# Altium schematic sheet Arduino.SchDoc: Arduino
size 420 x 297 mm; Author: P. Zdunek; CompanyName: WUT ISE; DrawnBy: P. Zdunek; Organization: WUT ISE; Address1: PW ISE; Address2: Nowowiejska 15/19 00-665 Warsaw; Address3: p.zdunek90@gmail.com; DocumentNumber: 2; Revision: 2; SheetNumber: 2; SheetTotal: 10; ModifiedBy: -; CheckedDate: -; DivGrp: WUT ISE; Designer: P. Zdunek; ModifiedDate: -; ProjectName: Sensor Box
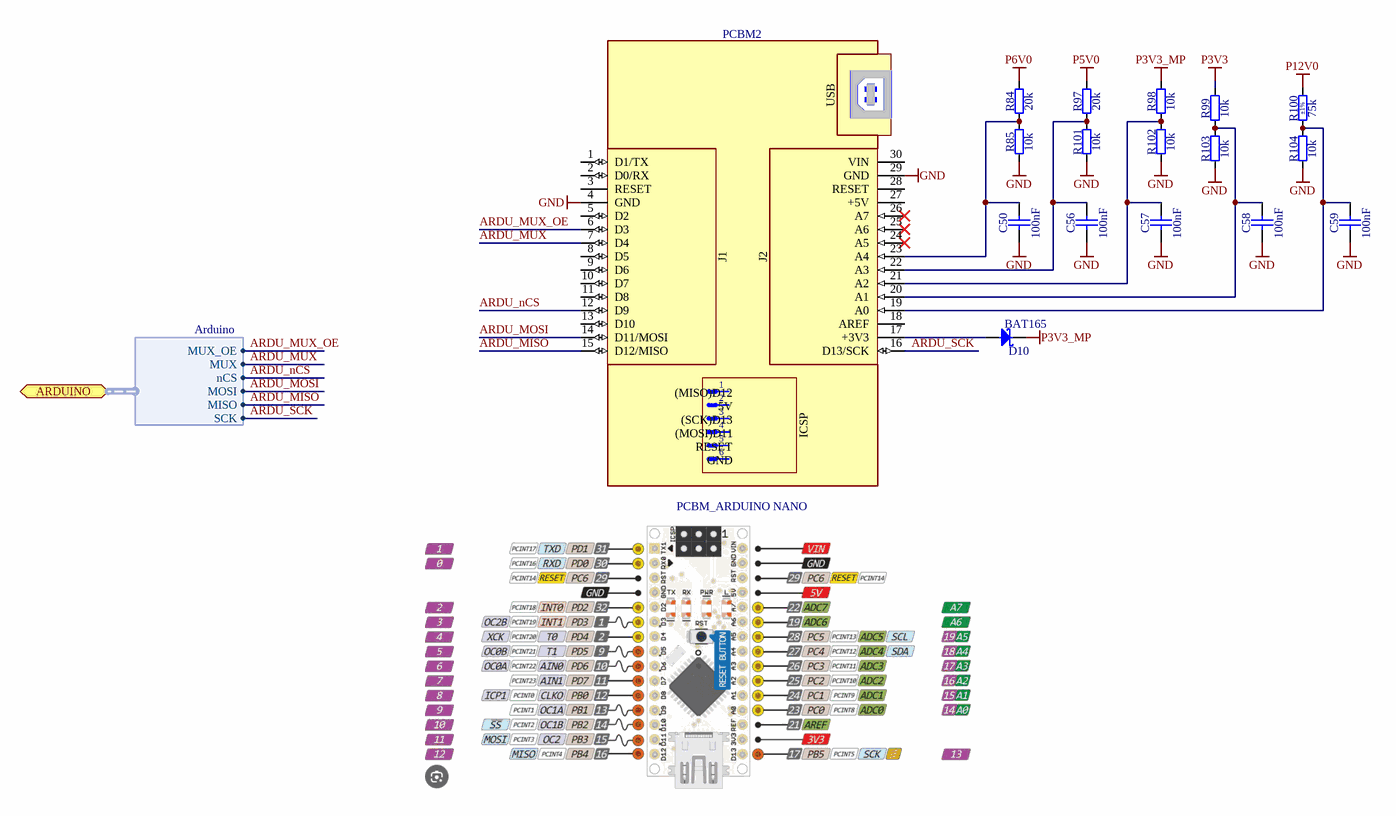
[diagram p0: Arduino.SchDoc]

## Parts
C50  100nF  [CAPC1005X55N]
C56  100nF  [CAPC1005X55N]
C57  100nF  [CAPC1005X55N]
C58  100nF  [CAPC1005X55N]
C59  100nF  [CAPC1005X55N]
D10  BAT165  [SOD2512X110N]
PCBM2  PCBM_ARDUINO NANO  [PCBM_ARDUINO NANO_a]
R84  20k  [RESC1608X55N]
R85  10k  [RESC1005X40N]
R97  20k  [RESC1608X55N]
R98  10k  [RESC1005X40N]
R99  10k  [RESC1005X40N]
R100  75k  Tolerance: ±1%  [RESC1608X55N]
R101  10k  [RESC1005X40N]
R102  10k  [RESC1005X40N]
R103  10k  [RESC1005X40N]
R104  10k  [RESC1005X40N]

## Ports
ARDUINO (bidir, harness Arduino)

## Harnesses
Arduino: nCS, MOSI, MISO, SCK, MUX_OE, MUX

## Nets
GND: C50.1 C56.1 C57.1 C58.1 C59.1 PCBM2.4(GND) PCBM2.29(GND) R85.1 R101.1 R102.1 R103.1 R104.1
P3V3: R99.2
P3V3_MP: D10.1(C) R98.2
P5V0: R97.2
P6V0: R84.2
P12V0: R100.2
ARDU_MISO: PCBM2.15(D12/MISO) ; port ARDUINO.MISO
ARDU_MOSI: PCBM2.14(D11/MOSI) ; port ARDUINO.MOSI
ARDU_MUX: PCBM2.7(D4) ; port ARDUINO.MUX
ARDU_MUX_OE: PCBM2.6(D3) ; port ARDUINO.MUX_OE
ARDU_nCS: PCBM2.12(D9) ; port ARDUINO.nCS
ARDU_SCK: PCBM2.16(D13/SCK) ; port ARDUINO.SCK
NetC50_2: C50.2 PCBM2.23(A4) R84.1 R85.2
NetC56_2: C56.2 PCBM2.22(A3) R97.1 R101.2
NetC57_2: C57.2 PCBM2.21(A2) R98.1 R102.2
NetC58_2: C58.2 PCBM2.20(A1) R99.1 R103.2
NetC59_2: C59.2 PCBM2.19(A0) R100.1 R104.2
NetD10_2: D10.2(A) PCBM2.17(+3V3)

Not connected (* = marked no-connect by the designer): PCBM2 1(D1/TX) 2(D0/RX) 3(RESET) 5(D2) 8(D5) 9(D6) 10(D7) 11(D8) 13(D10) 18(AREF) 24(A5)* 25(A6)* 26(A7)* 27(+5V) 28(RESET) 30(VIN)

## Notes on the sheet
- Project/Equipment
- Document
- Designer
- Drawn by
- Check.by
- Copyright WUT ISE 2020.
  This documentation describes Open Hardware and is licensed under the CERN OHL v.1.2. You may redistribute and modify this documentation under the terms of the CERN OHL v.1.2. (http://ohwr.org/CERNOHL). This documentation is distributed WITHOUT ANY EXPRESS OR IMPLIED WARRANTY, INCLUDING OF MERCHANTABILITY, SATISFACTORY QUALITY AND FITNESS FOR A PARTICULAR PURPOSE. Please see the CERN OHL v.1.2 for applicable conditions.
- Contact
- File
- Last Mod.
- Print Date
- Sheet
- Size
- A3
- of
- Rev
- (in symbol PCBM_ARDUINO NANO_a) USB; J1; J2; (MISO)D12; 5V; (SCK)D13; ICSP; (MOSI)D11

## Library data of the parts
C50 C56-C59 = CC0402_100NF_16V_10%_X5R: Non-polarised capacitor; Part Description: SMD Multilayer Chip Ceramic Capacitor; Manufacturer: GENERIC; Manufacturer1 Part Number: GRM155R61C104KA88D; Voltage: 16V; TC: X5R; Tolerance: ±10%; Part Number: CC0402_100NF_16V_10%_X5R; Component Kind: Standard; Component Type: Standard; Pin Count: 2; Value: 100nF; Status: None; Manufacturer Part Number: CC0402_100NF_16V_10%_X5R; Case: 0402; Mounted: Yes; Socket: No; SMD: Yes; Sense: No; Manufacturer1 Example: MURATA; Manufacturer1 ComponentHeight: 0.55mm; HelpURL: \\cern.ch\dfs\Applications\Altium\Datasheets\CC0402_X5R_MURATA_GRM.pdf; Author: CERN DEM JLC; CreateDate: 10/12/2013; LatestRevisionDate: 10/12/2013
D10 = BAT165: Schottky Diode; Part Description: Medium Power AF Schottky Diode; Manufacturer: INFINEON; Voltage: 40V; Power: 750mA; PressFit: No; Bonding: No; Part Number: BAT165; Component Kind: Standard; Component Type: Standard; Device: BAT165; PackageDescription: Small Outline Diode (SOD-323), 1.70mm W X 1.25mm L X 1.10mm H body,  IPC Medium Density; Manufacturer Part Number: BAT165; Pin Count: 2; Case: SOD-323; Mounted: Yes; Socket: No; SMD: Yes; Sense: No; ComponentHeight: 1.1mm; HelpURL: \\cern.ch\dfs\Applications\Altium\Datasheets\BAT165.pdf; Author: CERN DEM JLC; CreateDate: 12.11.2014; LatestRevisionDate: 12.11.2014
PCBM2 = PCBM_ARDUINO NANO_a: Arduino NANO Printed Circuit Board Module; PressFit: No; Sense Comment: Non-washable; Bonding: No; Part Number: PCBM_ARDUINO NANO_a; Component Kind: Standard; Component Type: Standard; Device: PCBM_ARDUINO NANO; PackageDescription: Microcontroller Board Arduino NANO; Part Description: Arduino NANO Printed Circuit Board Module; Manufacturer: ARDUINO; Manufacturer Part Number: ARDUINO NANO; Pin Count: 0; Mounted: Yes; Socket: No; SMD: No; Sense: Yes; ComponentHeight: 12.6mm; Author: CERN DEM HF; HelpURL: \\cern.ch\dfs\Applications\Altium\Datasheets\PCBM_ARDUINO NANO.pdf; CreateDate: 05.10.2022; LatestRevisionDate: 05.10.2022
R84 R97 = R0603_20K_1%_0.1W_100PPM: Resistor - 1%; Part Description: General Purpose Thick Film Chip Resistor; Manufacturer: GENERIC; Manufacturer1 Part Number: NRC06F2002TRF; Power: 0.1W; TC: ±100ppm/°C; PressFit: No; Part Number: R0603_20K_1%_0.1W_100PPM; Component Kind: Standard; Component Type: Standard; Pin Count: 2; Value: 20k; Status: Preferred; Tolerance: ±1%; Manufacturer Part Number: R0603_20K_1%_0.1W_100PPM; Case: 0603; Mounted: Yes; Sense: No; Socket: No; SMD: Yes; Manufacturer1 Example: NIC COMPONENT; Manufacturer1 ComponentHeight: 0.55mm; HelpURL: \\cern.ch\dfs\Applications\Altium\Datasheets\R0603_NIC_NRC.pdf; Author: CERN DEM JLC; CreateDate: 03/12/2007; LatestRevisionDate: 13/03/2008
R85 R98 R99 R101-R104 = R0402_10K_1%_0.0625W_100PPM: Resistor - 1%; Part Description: General Purpose Thick Film Chip Resistor; Manufacturer: GENERIC; Manufacturer1 Part Number: 232270671003L; TC: ±100ppm/°C; PressFit: No; Part Number: R0402_10K_1%_0.0625W_100PPM; Component Kind: Standard; Component Type: Standard; Pin Count: 2; Value: 10k; Status: Not Recommended; Power: 0.0625W; Tolerance: ±1%; Manufacturer Part Number: R0402_10K_1%_0.0625W_100PPM; Case: 0402; Mounted: Yes; Sense: No; Socket: No; SMD: Yes; Manufacturer1 Example: YAGEO PHYCOMP; Manufacturer1 ComponentHeight: 0.4mm; HelpURL: \\cern.ch\dfs\Applications\Altium\Datasheets\R0402_Phycomp_RC0402.pdf; Author: CERN DEM JLC; CreateDate: 03/12/2007; LatestRevisionDate: 17/10/2012
R100 = R0603_75K_1%_0.1W_100PPM: Resistor - 1%; Part Description: General Purpose Thick Film Chip Resistor; Manufacturer: GENERIC; Manufacturer1 Part Number: NRC06F7502TRF; Power: 0.1W; TC: ±100ppm/°C; PressFit: No; Part Number: R0603_75K_1%_0.1W_100PPM; Component Kind: Standard; Component Type: Standard; Pin Count: 2; Value: 75k; Status: Preferred; Manufacturer Part Number: R0603_75K_1%_0.1W_100PPM; Case: 0603; Mounted: Yes; Sense: No; Socket: No; SMD: Yes; Manufacturer1 Example: NIC COMPONENT; Manufacturer1 ComponentHeight: 0.55mm; HelpURL: \\cern.ch\dfs\Applications\Altium\Datasheets\R0603_NIC_NRC.pdf; Author: CERN DEM JLC; CreateDate: 03.12.2007; LatestRevisionDate: 13.03.2008